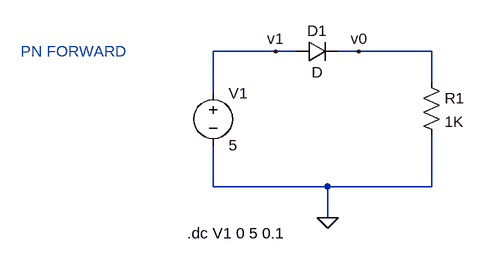
[diagram p0: schematic handdrawn_pn_forward.asc]
handdrawn_pn_forward.asc, the LTspice schematic file:
Version 4.1
SHEET 1 972 680
WIRE 240 48 144 48
WIRE 272 48 240 48
WIRE 368 48 336 48
WIRE 480 48 368 48
WIRE 480 96 480 48
WIRE 144 112 144 48
WIRE 144 256 144 192
WIRE 320 256 144 256
WIRE 480 256 480 176
WIRE 480 256 320 256
WIRE 320 304 320 256
FLAG 320 304 0
FLAG 240 48 v1
FLAG 368 48 v0
SYMBOL voltage 144 96 R0
WINDOW 123 0 0 Left 0
WINDOW 39 0 0 Left 0
SYMATTR InstName V1
SYMATTR Value 5
SYMBOL diode 272 64 R270
WINDOW 0 32 32 VTop 2
WINDOW 3 0 32 VBottom 2
SYMATTR InstName D1
SYMBOL res 464 80 R0
SYMATTR InstName R1
SYMATTR Value 1K
TEXT 104 328 Left 2 !.dc V1 0 5 0.1
TEXT -152 48 Left 2 ;PN FORWARD

The netlist it stands for:
* handdrawn_pn_forward.asc
V1 v1 0 5
D1 v1 v0 D
R1 v0 0 1K
.model D D
.lib standard.dio
.dc V1 0 5 0.1
* PN FORWARD
.backanno
.end